# Altium schematic sheet SharkPup-System.SchDoc
size A
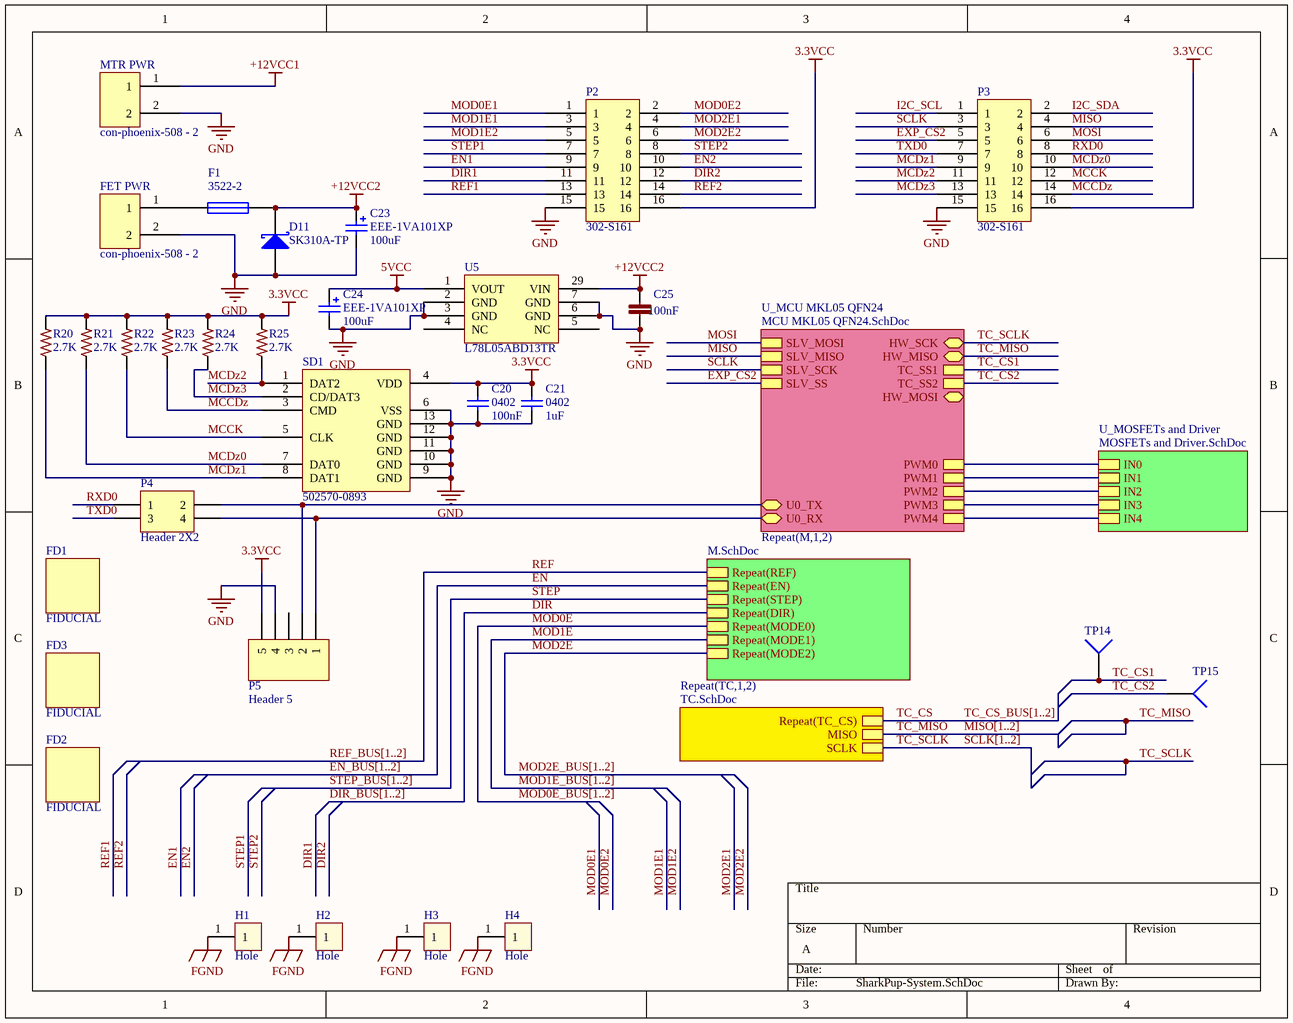
[diagram p0: SharkPup-System.SchDoc]

## Parts
C20  value 100nF  [C0402]  (hidden comment: 0402)
C21  value 1uF  [C0402]  (hidden comment: 0402)
C23  EEE-1VA101XP  value 100uF  [EEE-1VA101XP]
C24  EEE-1VA101XP  value 100uF  [EEE-1VA101XP]
C25  100nF  [C0603]
D11  SK310A-TP  [SK310A-TP]
F1  3522-2  [3522-2 - WAVE SOLDER]
FD1  FIDUCIAL  [FIDUCIAL-1X2]
FD2  FIDUCIAL  [FIDUCIAL-1X2]
FD3  FIDUCIAL  [FIDUCIAL-1X2]
FET_PWR  con-phoenix-508 - 2  [MSTBV2 - duplicate]
H1  Hole  [Wave_hole_3x7-singleSided]  (no BOM)
H2  Hole  [Wave_hole_3x7-singleSided]  (no BOM)
H3  Hole  [Wave_hole_3x7-singleSided]  (no BOM)
H4  Hole  [Wave_hole_3x7-singleSided]  (no BOM)
MTR_PWR  con-phoenix-508 - 2  [MSTBV2 - duplicate]
P2  302-S161  [302-S161]
P3  302-S161  [302-S161]
P4  Header 2X2  [HDR2X2]
P5  Header 5  [HDR1X5]
R20  2.7K  [R0402]
R21  2.7K  [R0402]
R22  2.7K  [R0402]
R23  2.7K  [R0402]
R24  2.7K  [R0402]
R25  2.7K  [R0402]
SD1  502570-0893  [502570-0893 - Molex SD]
TP14  TP4  [TP-2]  (value not drawn)
TP15  TP4  [TP-2]  (value not drawn)
U5  L78L05ABD13TR  [L78L05ABD13TR]

## Sub-sheets
Repeat(M,1,2) = M.SchDoc: Repeat(REF), Repeat(EN), Repeat(STEP), Repeat(DIR), Repeat(MODE0), Repeat(MODE1), Repeat(MODE2)
Repeat(TC,1,2) = TC.SchDoc: SCLK, MISO, Repeat(TC_CS)
U_MCU MKL05 QFN24 = MCU MKL05 QFN24.SchDoc: TC_SS1, TC_SS2, SLV_MOSI, SLV_MISO, SLV_SCK, SLV_SS, PWM4, PWM3, PWM2, PWM1, PWM0, HW_MISO, HW_MOSI, HW_SCK, U0_TX, U0_RX
U_MOSFETs and Driver = MOSFETs and Driver.SchDoc: IN0, IN1, IN2, IN3, IN4

## Nets
3.3VCC: C20.2 C21.2 P2.16 P3.16 P5.5 R20.2 R21.2 R22.2 R23.2 R24.2 R25.2 SD1.4(VDD)
5VCC: C24.1 U5.1(VOUT)
+12VCC1: MTR_PWR.1
+12VCC2: C23.1 C25.1 D11.2(K) F1.2 U5.29(VIN)
FGND: H1.1 H2.1 H3.1 H4.1
GND: C20.1 C21.1 C23.2 C24.2 C25.2 D11.1(A) FET_PWR.2 MTR_PWR.2 P2.15 P3.15 P5.4 SD1.6(VSS) SD1.9(GND) SD1.10(GND) SD1.11(GND) SD1.12(GND) SD1.13(GND) U5.2(GND) U5.3(GND) U5.6(GND) U5.7(GND)
DIR: sheet Repeat(M,1,2)/Repeat(DIR)
DIR1: P2.11
DIR2: P2.12
EN: sheet Repeat(M,1,2)/Repeat(EN)
EN1: P2.9
EN2: P2.10
EXP_CS2: P3.5 ; sheet U_MCU MKL05 QFN24/SLV_SS
I2C_SCL: P3.1
I2C_SDA: P3.2
MCCDz: P3.14 R23.1 SD1.3(CMD)
MCCK: P3.12 R22.1 SD1.5(CLK)
MCDz0: P3.10 R21.1 SD1.7(DAT0)
MCDz1: P3.9 R20.1 SD1.8(DAT1)
MCDz2: P3.11 R25.1 SD1.1(DAT2)
MCDz3: P3.13 R24.1 SD1.2(CD/DAT3)
MISO: P3.4 ; sheet U_MCU MKL05 QFN24/SLV_MISO
MOD0E: sheet Repeat(M,1,2)/Repeat(MODE0)
MOD0E1: P2.1
MOD0E2: P2.2
MOD1E: sheet Repeat(M,1,2)/Repeat(MODE1)
MOD1E1: P2.3
MOD1E2: P2.5
MOD2E: sheet Repeat(M,1,2)/Repeat(MODE2)
MOD2E1: P2.4
MOD2E2: P2.6
MOSI: P3.6 ; sheet U_MCU MKL05 QFN24/SLV_MOSI
REF: sheet Repeat(M,1,2)/Repeat(REF)
REF1: P2.13
REF2: P2.14
RXD0: P3.8 P4.1
SCLK: P3.3 ; sheet U_MCU MKL05 QFN24/SLV_SCK
STEP: sheet Repeat(M,1,2)/Repeat(STEP)
STEP1: P2.7
STEP2: P2.8
TC_CS: sheet Repeat(TC,1,2)/Repeat(TC_CS)
TC_CS1: TP14.1 ; sheet U_MCU MKL05 QFN24/TC_SS1
TC_CS2: TP15.1 ; sheet U_MCU MKL05 QFN24/TC_SS2
TC_MISO: sheet Repeat(TC,1,2)/MISO, sheet U_MCU MKL05 QFN24/HW_MISO
TC_SCLK: sheet Repeat(TC,1,2)/SCLK, sheet U_MCU MKL05 QFN24/HW_SCK
TXD0: P3.7 P4.3
NetF1_1: F1.1 FET_PWR.1
NetP4_2: P4.2 P5.2 ; sheet U_MCU MKL05 QFN24/U0_TX
NetP4_4: P4.4 P5.1 ; sheet U_MCU MKL05 QFN24/U0_RX
(unnamed): sheet U_MOSFETs and Driver/IN0, sheet U_MCU MKL05 QFN24/PWM0
(unnamed): sheet U_MOSFETs and Driver/IN1, sheet U_MCU MKL05 QFN24/PWM1
(unnamed): sheet U_MOSFETs and Driver/IN2, sheet U_MCU MKL05 QFN24/PWM2
(unnamed): sheet U_MOSFETs and Driver/IN3, sheet U_MCU MKL05 QFN24/PWM3
(unnamed): sheet U_MOSFETs and Driver/IN4, sheet U_MCU MKL05 QFN24/PWM4

Not connected (* = marked no-connect by the designer): P5 3; U5 4(NC) 5(NC) 23(NC)

## Buses and harness runs
bus DIR_BUS[1..2]
bus EN_BUS[1..2]
bus MISO[1..2]
bus MOD0E_BUS[1..2]
bus MOD1E_BUS[1..2]
bus MOD2E_BUS[1..2]
bus REF_BUS[1..2]
bus SCLK[1..2]
bus STEP_BUS[1..2]
bus TC_CS_BUS[1..2]

## Library data of the parts
C20 = GRM155R71C104KA88D: CAP CER 0.1UF (100nF) 16V 10% X7R 0402; MFR: Murata; Part Description: CAP CER 0.1UF 16V 10% X7R 0402; Published: 10 - Dec - 2014; LatestRevisionDate: 10 - Dec - 2014; LatestRevisionNote: Ultimachine Footprint Added; Publisher: Ultimachine; Component Type: Chip Capacitor; MFR Part #: GRM155R71C104KA88D; Mounting Type: SMT 0402; Datasheet: http://psearch.murata.com/capacitor/product/GRM155R71C104KA88%23.pdf; Height: 0.5 ±0.05mm; Tolerance: 10%; Voltage: 16v; PackageReference: 0402
C21 = GRM155R60J105KE19D: CAP CER 1UF 6.3V 10% X5R 0402; MFR: Murata; Voltage: 6.3VDC; Published: 10 - Dec - 2014; LatestRevisionDate: 10 - Dec - 2014; LatestRevisionNote: Ultimachine Footprint Added; Publisher: Ultimachine; Component Type: Chip Capacitor; MFR Part #: GRM155R60J105KE19D; Part Description: CAP CER 1UF 6.3V 10% X5R 0402; Mounting Type: SMT 0402; Datasheet: http://psearch.murata.com/capacitor/product/GRM155R60J105KE19%23.pdf; Height: 0.55mm; Tolerance: 10%; PackageReference: 0402
C23 C24 = EEE-1VA101XP: CAP ALUM 100UF 35V 20% SMD; Manufacture: Panasonic; Digikey Part #: PCE3951CT-ND; Price: $0.63; Mount Type: SMT Panasonic VS D Series; Status: Active; Height: 7.70mm; Datasheet: http://industrial.panasonic.com/www-cgi/jvcr13pz.cgi?E+PZ+3+ABA0002+EEE1VA101XP+7+WW; Manufacture Part #: EEE-1VA101XP
C25 = C0603C104K5RACTU: CAP CER 0603 100nF 50V 10% X7R; LastRevisionNote: ImportComponents; Published: 23-Apr-2014; Publisher: UltiMachine; LastRevisionDate: 23-Apr-2014; ManufacturerPartNumber: C0603C104K5RACTU; VALUE: 100nF
D11 = D Schottky: Schottky Diode; Published: 8-Jun-2000; LatestRevisionDate: 17-Jul-2002; LatestRevisionNote: Re-released for DXP Platform.; PackageReference: SMB; Publisher: Altium Limited; PackageDescription: DO-214-AA/SMB; 2 C-Bend Leads; Body 5.3 x 3.6 mm, inc. leads (LxW); Code_JEDEC: DO-214-AA
F1 = Fuse 1: Fuse; Published: 8-Jun-2000; LatestRevisionDate: 17-Jul-2002; LatestRevisionNote: Re-released for DXP Platform.; PackageReference: PIN-W2/E2.8; Publisher: Altium Limited; PackageDescription: Thru-Hole; 2 Leads
FET_PWR MTR_PWR = con-phoenix-508_2
P2 P3 = 302-S161: 16 Pos 2.54mm Pin Connector Shrouded; Manufacture: On Shore Technology Inc; Value: 2.54mm Pitch Spacing; Manufature Part #: 302-S161; Datasheet: http://www.on-shore.com/sites/default/files/manuals/302-sxxx.pdf; Digikey Part #: ED10522-ND; Pin Count: 16; Type: Throughhole connector; Mount Type: Through hole; Price: $0.40; Height: 9.1mm
P4 = Header 2X2: Header, 2-Pin, Dual row; LatestRevisionDate: 17-Jul-2002; LatestRevisionNote: Re-released for DXP Platform.; Publisher: Altium Limited
P5 = Header 5: Header, 5-Pin; LatestRevisionDate: 17-Jul-2002; LatestRevisionNote: Re-released for DXP Platform.; Publisher: Altium Limited
R20-R25 = ERJ-2RKF2701X: RES SMD 2.7K OHM 1% 1/10W 0402; Manufacturer: Panasonic; ManufacturerPartNumber: ERJ2GEJ105X; LastRevisionNote: ImportComponents; Published: 23-Apr-2014; Publisher: Adam; LastRevisionDate: 23-Apr-2014; VALUE: 2.7K
SD1 = 502570-0893: microSD 502570-0893 Molex Part
TP14 TP15 = Socket: LatestRevisionDate: 17-Jul-2002; LatestRevisionNote: Re-released for DXP Platform.; Publisher: Altium Limited
U5 = L78L05ABD13TR: IC REG LDO 5V 0.1A 8SO; Manufacturer: ST Microelectronics; Mountining Type: SOIC8; Voltage: 30V; Cost (1000 qty): $0.44; Manfacture Part Number: L78L05ABD13TR; Status: In-Production; Pins: 28 Pins and one Exposed Pad; Datasheet: http://www.st.com/web/en/resource/technical/document/datasheet/CD00000446.pdf; Height: 1.2mm; Tolerance: N/A; Type: 5V 100mA LDO; Lead Free: YES